# EAGLE design macro_rat (EAGLE 9.6.2)
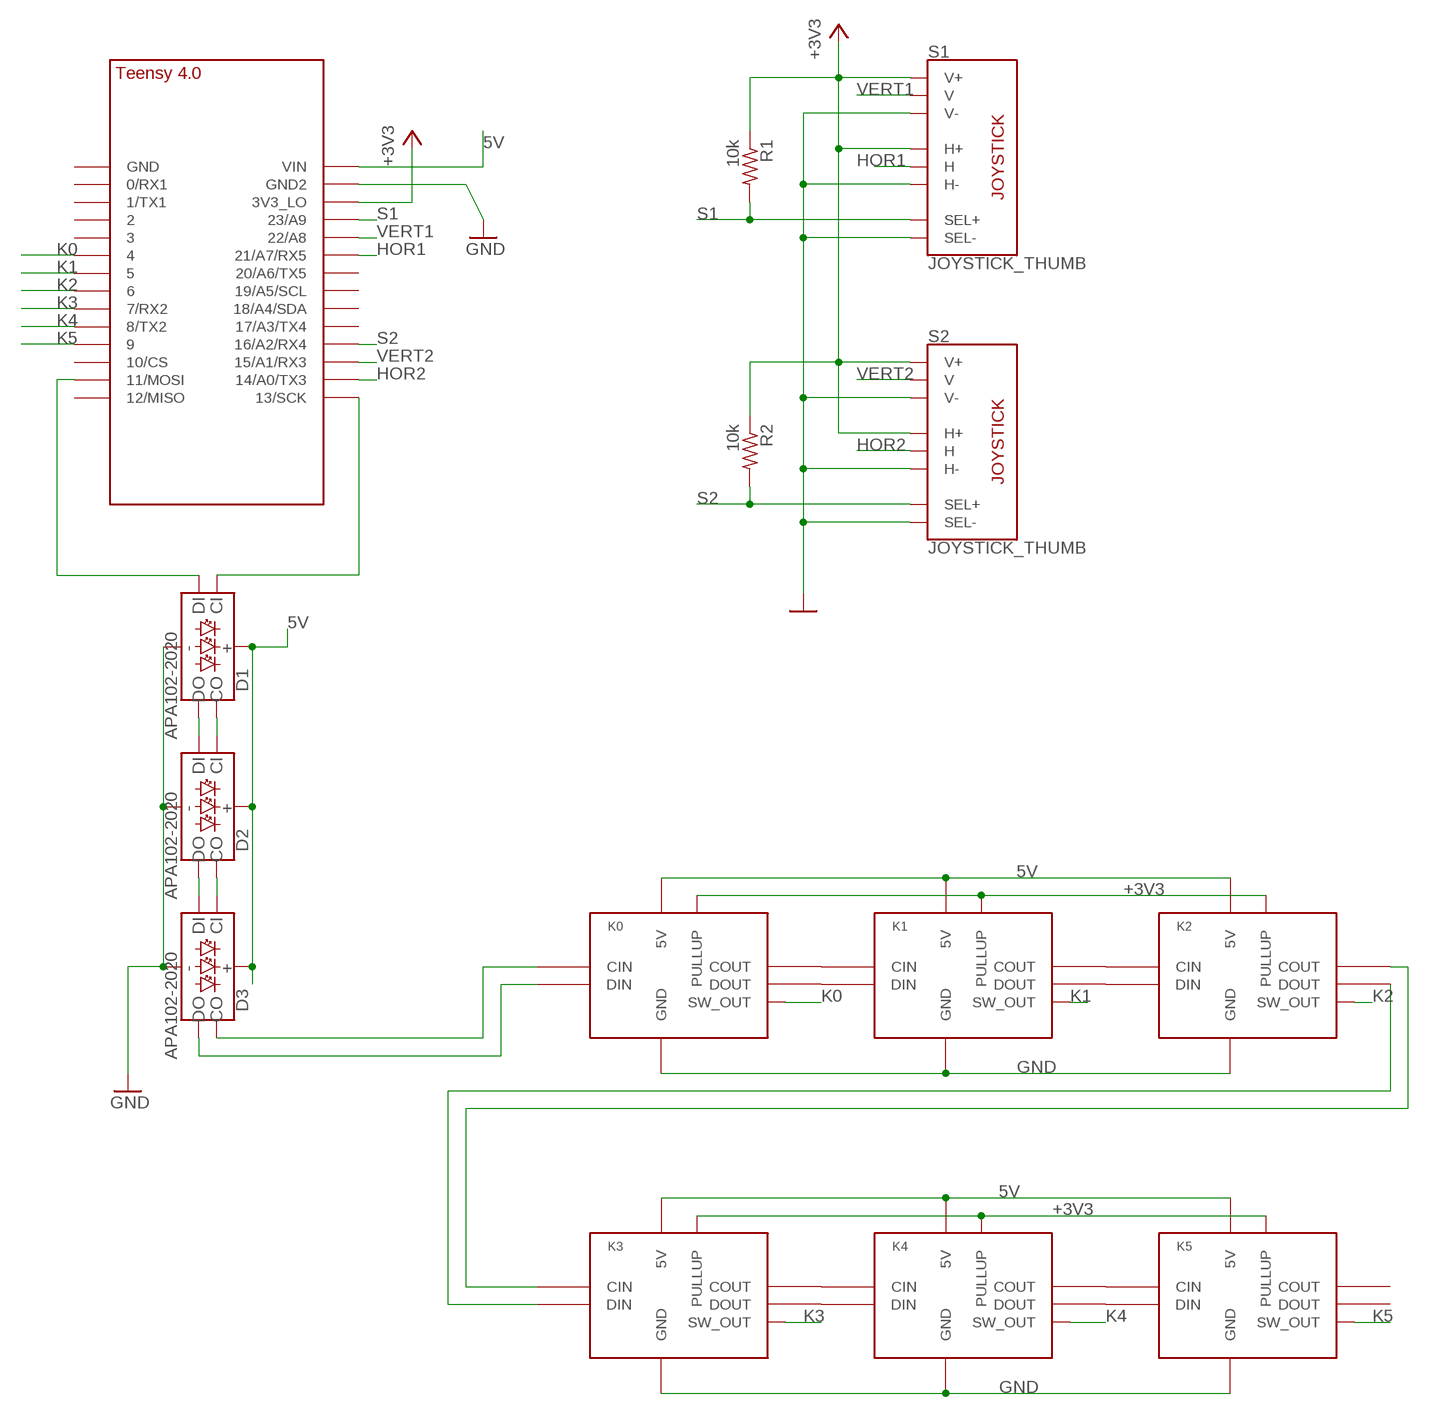
[diagram p0: schematic, sheet 1]

## Parts
D1  APA102-2020  [APA102-2020]
D2  APA102-2020  [APA102-2020]
D3  APA102-2020  [APA102-2020]
K0  KEY_LED_CHOC_ONESIDERIGHT_HAND  [KEY_CHOC_V2_RH]
K1  KEY_LED_CHOC_ONESIDERIGHT_HAND  [KEY_CHOC_V2_RH]
K2  KEY_LED_CHOC_ONESIDERIGHT_HAND  [KEY_CHOC_V2_RH]
K3  KEY_LED_CHOC_ONESIDERIGHT_HAND  [KEY_CHOC_V2_RH]
K4  KEY_LED_CHOC_ONESIDERIGHT_HAND  [KEY_CHOC_V2_RH]
K5  KEY_LED_CHOC_ONESIDERIGHT_HAND  [KEY_CHOC_V2_RH]
MCU  TEENSY_4.0-NOBOTTOM  [TEENSY_4.0-NOBOTTOM]
R1  10k  R-US_R0603  [R0603]
R2  10k  R-US_R0603  [R0603]
S1  JOYSTICK_THUMB  [JOYSTICK]
S2  JOYSTICK_THUMB  [JOYSTICK]

## Nets
5V: D1.5V_VIA(VCC) D1.VDD(VCC) D2.5V_VIA(VCC) D2.VDD(VCC) D3.5V_VIA(VCC) D3.VDD(VCC) K0.5V K0.VDD(5V) K1.5V K1.VDD(5V) K2.5V K2.VDD(5V) K3.5V K3.VDD(5V) K4.5V K4.VDD(5V) K5.5V K5.VDD(5V) MCU.VIN
+3V3: K0.PULLUP_V(PULLUP) K0.PULLUP_VIA(PULLUP) K1.PULLUP_V(PULLUP) K1.PULLUP_VIA(PULLUP) K2.PULLUP_V(PULLUP) K2.PULLUP_VIA(PULLUP) K3.PULLUP_V(PULLUP) K3.PULLUP_VIA(PULLUP) K4.PULLUP_V(PULLUP) K4.PULLUP_VIA(PULLUP) K5.PULLUP_V(PULLUP) K5.PULLUP_VIA(PULLUP) MCU.3V3_LO R1.1 R2.1 S1.H1(H+) S1.V1(V+) S2.H1(H+) S2.V1(V+)
GND: D1.GND D1.GND_VIA(GND) D2.GND D2.GND_VIA(GND) D3.GND D3.GND_VIA(GND) K0.GND K0.GND$1(GND) K0.GND$2(GND) K0.GND$3(GND) K0.GND$4(GND) K0.GND_VIA(GND) K1.GND K1.GND$1(GND) K1.GND$2(GND) K1.GND$3(GND) K1.GND$4(GND) K1.GND_VIA(GND) K2.GND K2.GND$1(GND) K2.GND$2(GND) K2.GND$3(GND) K2.GND$4(GND) K2.GND_VIA(GND) K3.GND K3.GND$1(GND) K3.GND$2(GND) K3.GND$3(GND) K3.GND$4(GND) K3.GND_VIA(GND) K4.GND K4.GND$1(GND) K4.GND$2(GND) K4.GND$3(GND) K4.GND$4(GND) K4.GND_VIA(GND) K5.GND K5.GND$1(GND) K5.GND$2(GND) K5.GND$3(GND) K5.GND$4(GND) K5.GND_VIA(GND) MCU.GND2 S1.B2A(SEL-) S1.H3(H-) S1.V3(V-) S2.B2A(SEL-) S2.H3(H-) S2.V3(V-)
HOR1: MCU.21/A7(21/A7/RX5) S1.H2(H)
HOR2: MCU.14/A0(14/A0/TX3) S2.H2(H)
K0: K0.OUT(SW_OUT) K0.OUT_UP(SW_OUT) MCU.4/CANRX
K1: K1.OUT(SW_OUT) K1.OUT_UP(SW_OUT) MCU.5
K2: K2.OUT(SW_OUT) K2.OUT_UP(SW_OUT) MCU.6
K3: K3.OUT(SW_OUT) K3.OUT_UP(SW_OUT) MCU.7(7/RX2)
K4: K4.OUT(SW_OUT) K4.OUT_UP(SW_OUT) MCU.8(8/TX2)
K5: K5.OUT(SW_OUT) K5.OUT_UP(SW_OUT) MCU.9/CS
N$1: K0.CKO(COUT) K1.CKI(CIN)
N$2: K0.SDO(DOUT) K1.SDI(DIN)
N$3: K1.CKO(COUT) K2.CKI(CIN)
N$4: K1.SDO(DOUT) K2.SDI(DIN)
N$5: K3.CKO(COUT) K4.CKI(CIN)
N$6: K3.SDO(DOUT) K4.SDI(DIN)
N$7: K4.CKO(COUT) K5.CKI(CIN)
N$8: D1.SDO(DO) D2.SDI(DI)
N$9: D1.CKO(CO) D2.CKI(CI)
N$10: D2.SDO(DO) D3.SDI(DI)
N$11: D2.CKO(CO) D3.CKI(CI)
N$12: D1.CKI(CI) MCU.13/SCK
N$13: D1.SDI(DI) MCU.11/MOSI
N$14: K4.SDO(DOUT) K5.SDI(DIN)
N$15: D3.CKO(CO) K0.CKI(CIN)
N$16: D3.SDO(DO) K0.SDI(DIN)
N$17: K2.SDO(DOUT) K3.SDI(DIN)
N$18: K2.CKO(COUT) K3.CKI(CIN)
S1: MCU.23/A9 R1.2 S1.B1A(SEL+)
S2: MCU.16/A2(16/A2/RX4) R2.2 S2.B1A(SEL+)
VERT1: MCU.22/A8 S1.V2(V)
VERT2: MCU.15/A1(15/A1/RX3) S2.V2(V)
Unconnected: K5.CKO(COUT) K5.SDO(DOUT) MCU.0/RX(0/RX1) MCU.1/TX(1/TX1) MCU.2 MCU.3/CANTX MCU.10/CS MCU.12/MISO MCU.17/A3(17/A3/TX4) MCU.18/A4/SDA MCU.19/A5/SCL MCU.20/A6(20/A6/TX5) MCU.GND

## Library data of the parts
D1-D3 = custom:APA102: Addressable RGB LED - 2 Wire Common names: APA102, Dotstar, etc. Packages: 5050 2020 SparkFun Products: SparkFun Lumenati Boards <https://www.sparkfun.com/categories/405>; PROD_ID: DIO-14111
K0 K1-K5 = custom:KEY_LED_CHOC_ONESIDE
MCU = Teensy-4.0:TEENSY_4.0-NOBOTTOM
R1 R2 = adafruit:R-US_: RESISTOR, American symbol
S1 S2 = SparkFun-Switches:JOYSTICK_THUMB: Analog Thumb Joystick This is a joystick very similar to the ‘analog’ joysticks on PS2 (PlayStation 2) controllers. Directional movements are simply two potentiometers - one for each axis. Pots are ~10k each. This joystick also has a select button that is actuated when the joystick is pressed down. SparkFun Products Thumb Joystick <https://www.sparkfun.com/products/9032> (COM-09032) SparkFun Thumb Joystick Breakout <https://www.sparkfun.com/products/9110> (BOB-09110) SparkFun Joystick Shield Kit <https://www.sparkfun.com/products/9760> (DEV-09760); PROD_ID: COMP-09744; SF_SKU: COM-09032

## Net classes
0 default: width 0.127 mm

## Board
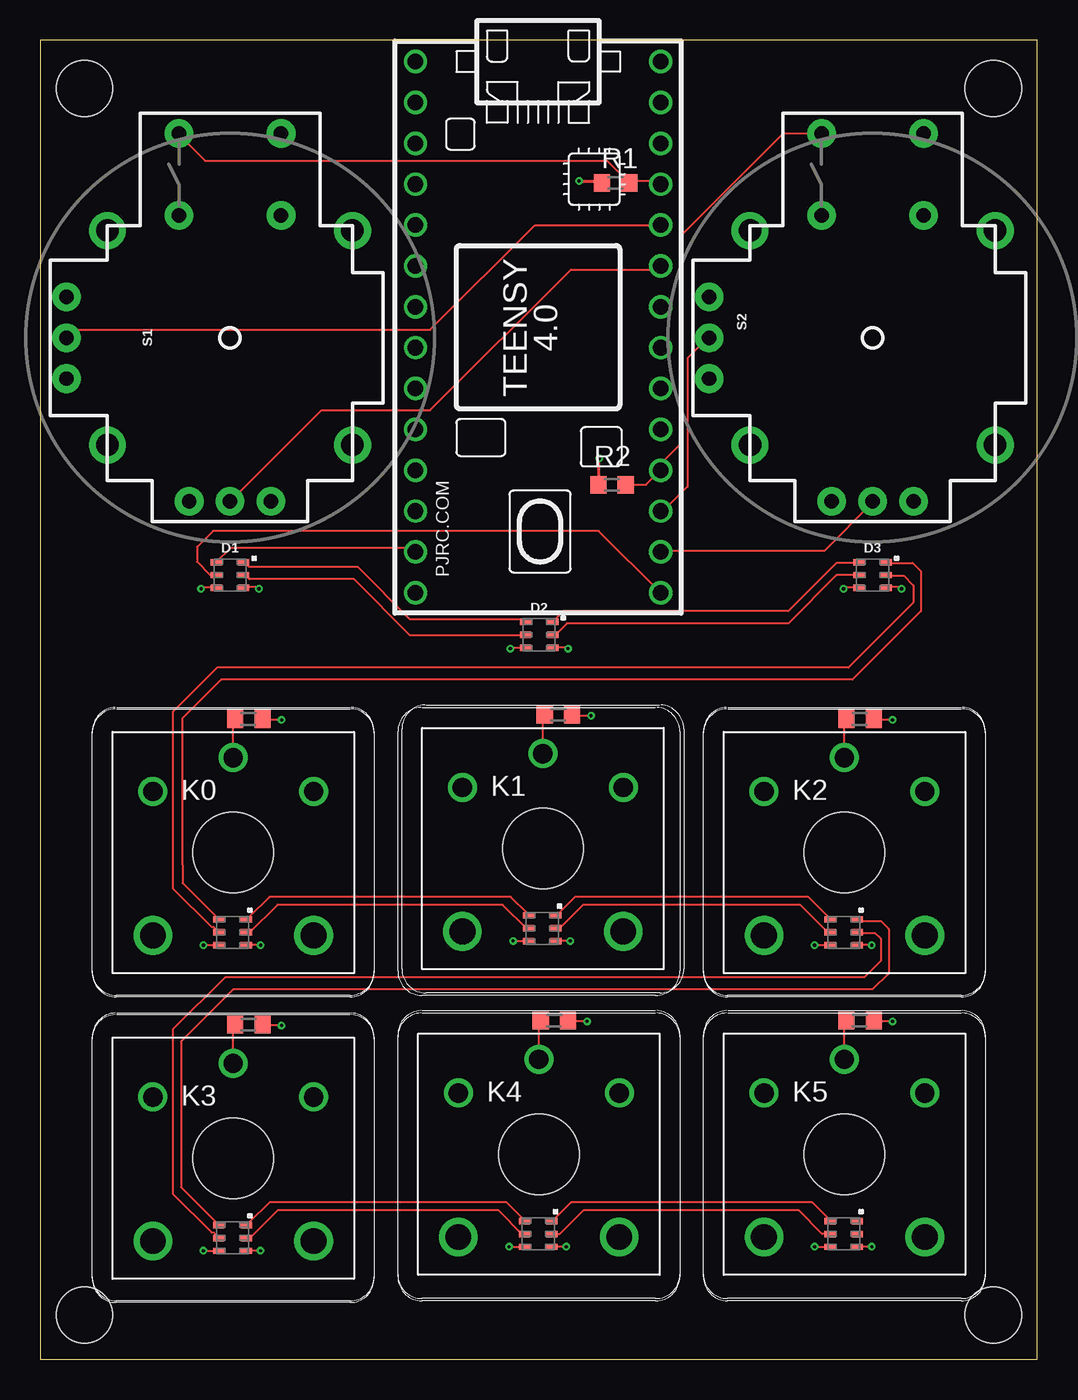
[diagram p1: board, top side]
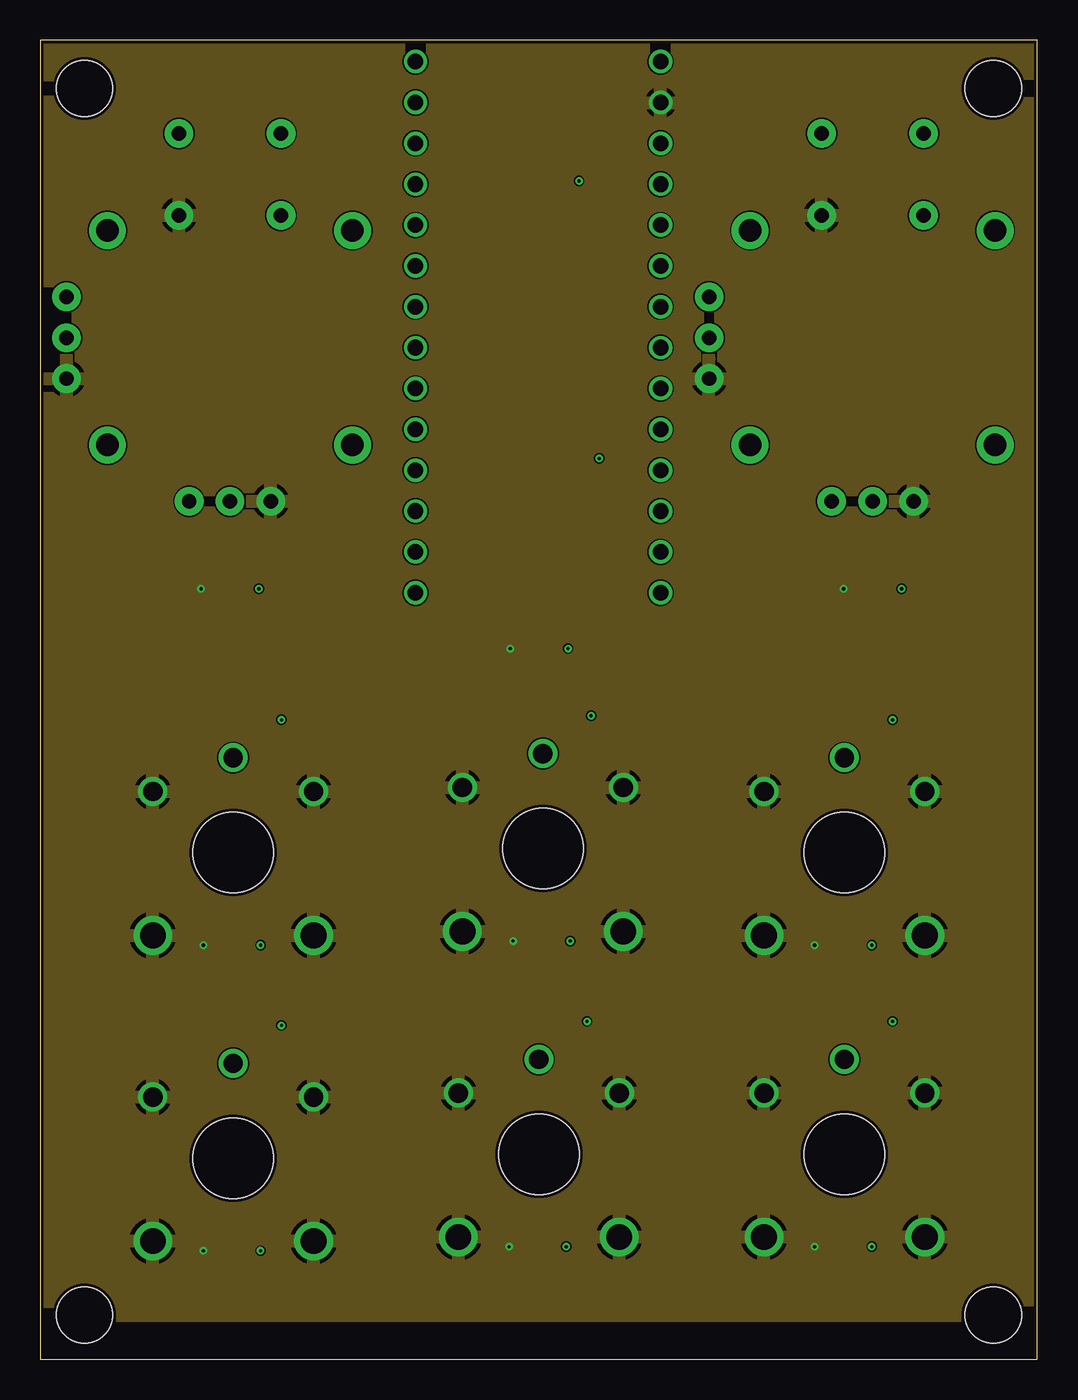
[diagram p2: board, inner layer Route2]
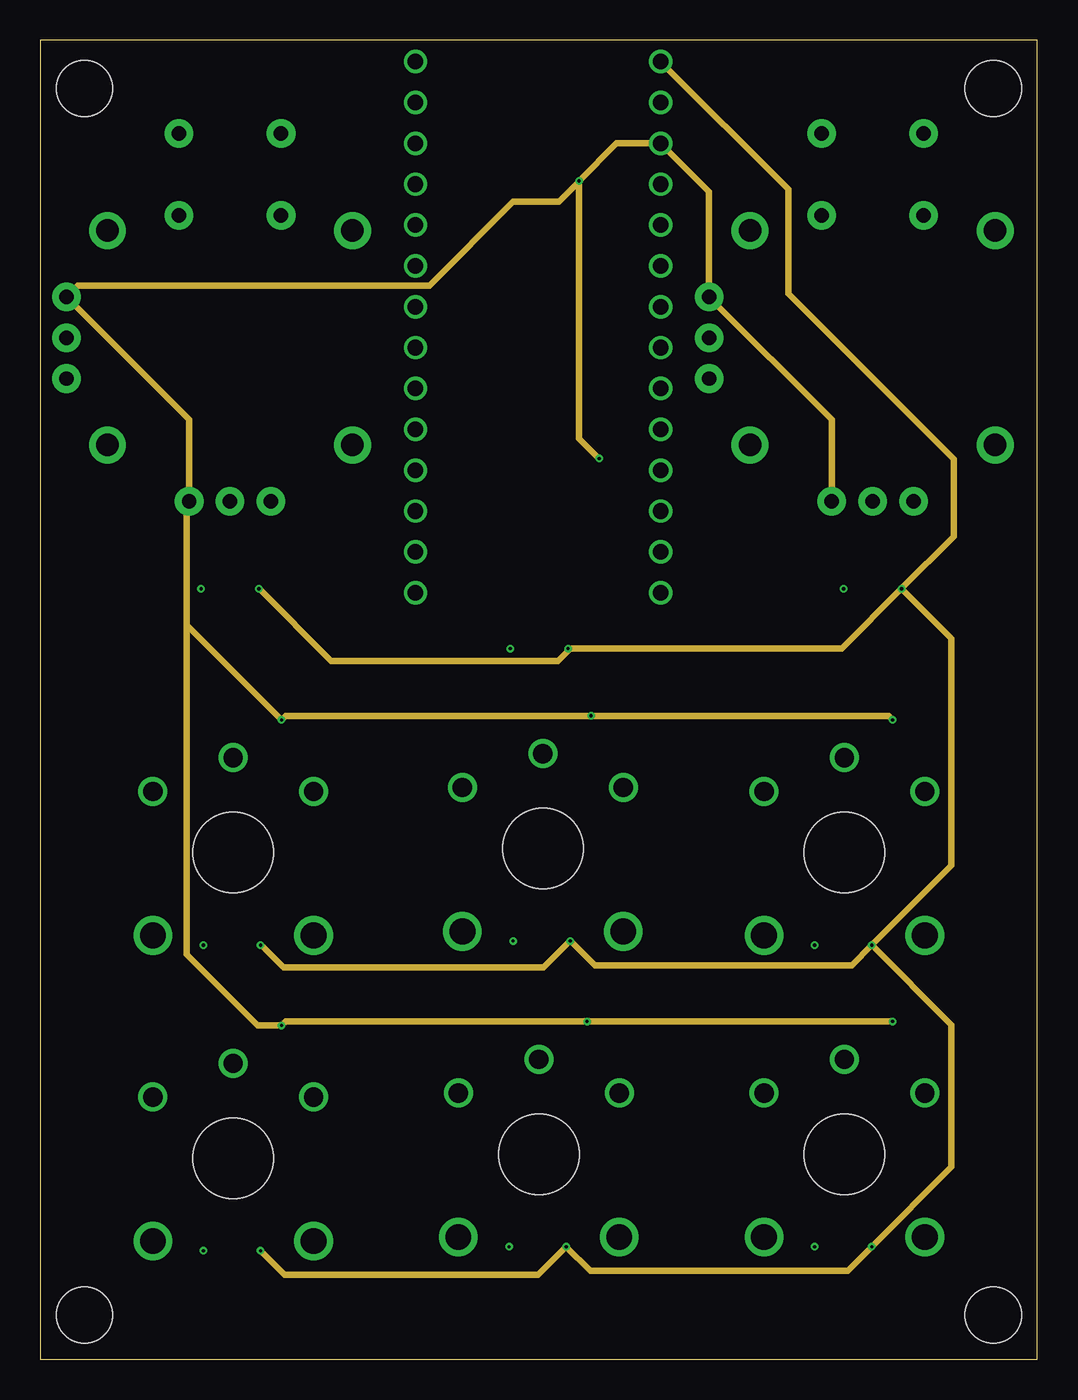
[diagram p3: board, inner layer Route15]
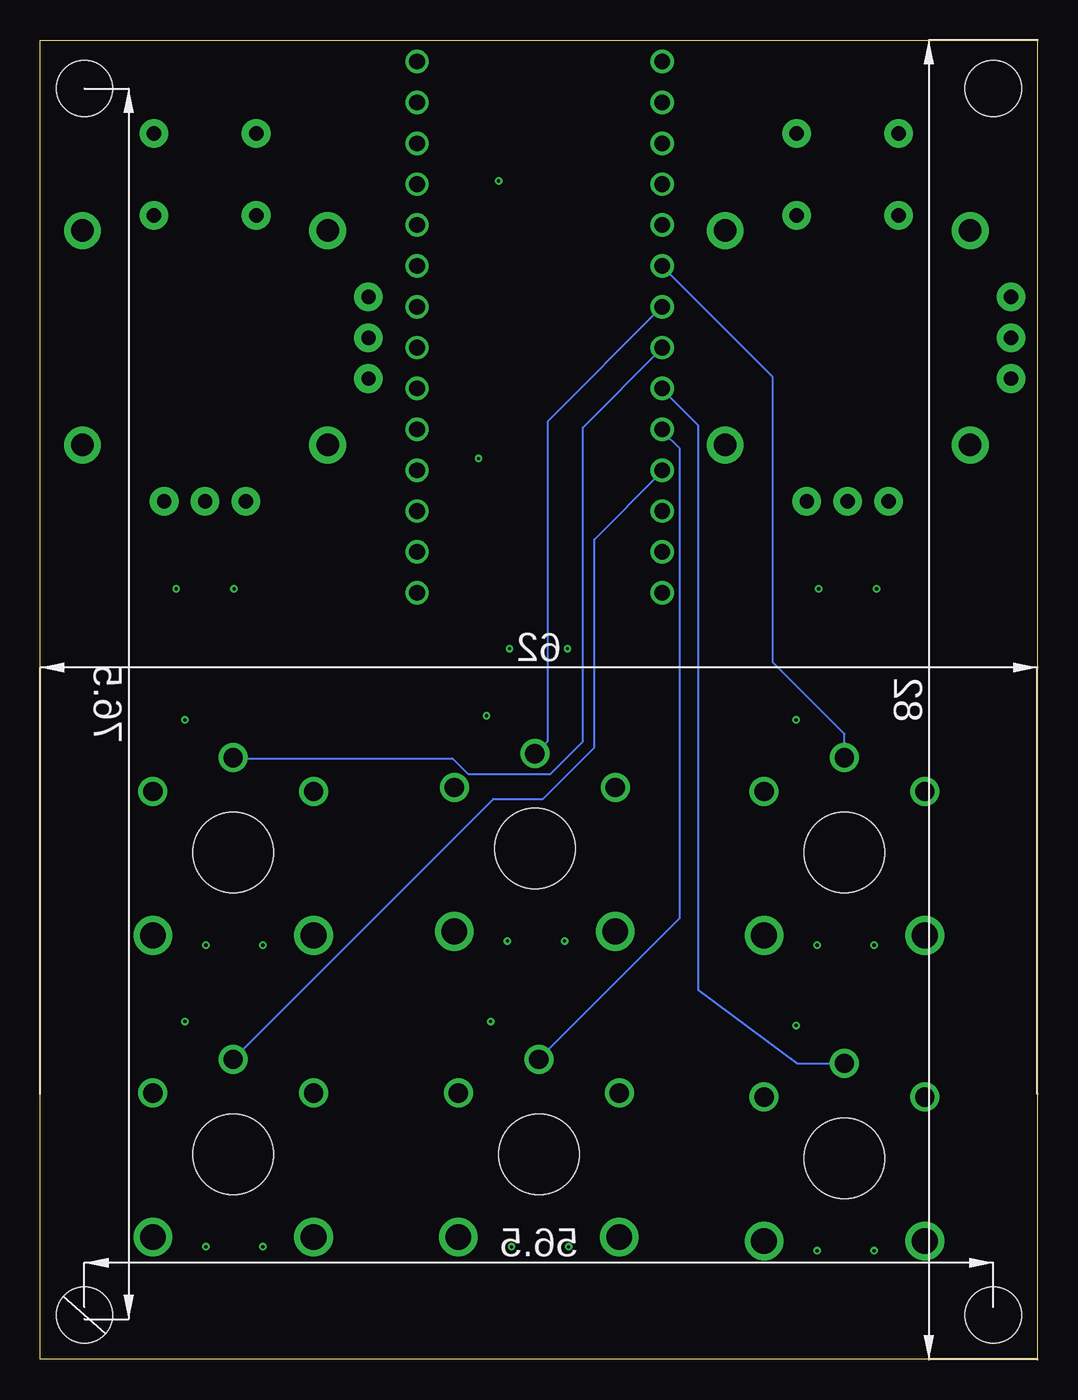
[diagram p4: board, bottom side, seen from below]

Size 62 x 82 mm. Coordinates in mm from the lower left corner, seen from the top.
Outline: 0,0 62,0 62,82 0,82 0,0
Copper layers (1+2*15+16): Top 0.035mm / dielectric 0.2mm / Route2 0.035mm / dielectric 0.15mm / Route15 0.035mm / dielectric 0.2mm / Bottom 0.035mm
Design rules "jlcpcb": minimum track width 3.5mil, minimum drill 0.2mm, track to track 3.5mil, track to pad 0.2mm, pad to pad 5mil, via to via 10mil, smd to smd 5mil, copper to edge 0.2mm, drill to drill 0.5mm, minimum pad ring 0.13mm, minimum via ring 0.13mm, stop-mask expansion 4mil, vias tented up to drill 0mil, thermal gap 10mil
Holes 3.5 mm at 2.75,2.75 59.25,2.75 59.25,79 2.75,79

### Footprints (pad centres in the part's own frame; a part is rotated, then mirrored left to right if it is on the bottom)
APA102-2020 = drill 0.2: 5V_VIA 1.8,-0.6; GND_VIA -1.8,-0.6 | smd 0.7 x 0.4: CKI -0.85,0.254; CKO 0.85,0.254; GND -0.85,-0.546; SDI -0.85,1.054; SDO 0.85,1.054; VDD 0.85,-0.546
KEY_CHOC_V2_RH = drill 0.2: 5V 9.2,1.75; GND_VIA 5.65,1.75; PULLUP_VIA 10.5,15.75 | smd 0.7 x 0.4: CKI 6.61,2.543; CKO 8.31,2.543; GND 6.61,1.743; SDI 6.61,3.343; SDO 8.31,3.343; VDD 8.31,1.743 | drill 1.6: GND$1 2.5,2.35; GND$2 12.5,2.35 | drill 1.2: GND$3 12.5,11.3; GND$4 2.5,11.3; OUT 7.5,13.4 | smd 1 x 1.1: OUT_UP 7.62,15.81; PULLUP_V 9.32,15.81 | hole 5: 7.5,7.5
TEENSY_4.0-NOBOTTOM = drill 0.965: 0/RX -13.97,-7.62; 1/TX -11.43,-7.62; 2 -8.89,-7.62; 3/CANTX -6.35,-7.62; 3V3_LO -11.43,7.62; 4/CANRX -3.81,-7.62; 5 -1.27,-7.62; 6 1.27,-7.62; 7 3.81,-7.62; 8 6.35,-7.62; 9/CS 8.89,-7.62; 10/CS 11.43,-7.62; 11/MOSI 13.97,-7.62; 12/MISO 16.51,-7.62; 13/SCK 16.51,7.62; 14/A0 13.97,7.62; 15/A1 11.43,7.62; 16/A2 8.89,7.62; 17/A3 6.35,7.62; 18/A4/SDA 3.81,7.62; 19/A5/SCL 1.27,7.62; 20/A6 -1.27,7.62; 21/A7 -3.81,7.62; 22/A8 -6.35,7.62; 23/A9 -8.89,7.62; GND -16.51,-7.62; GND2 -13.97,7.62; VIN -16.51,7.62
R0603 = smd 1 x 1.1: 1 -0.85,0; 2 0.85,0
JOYSTICK = drill 0.9 pad 1.778: B1A -3.175,12.7; B1B 3.175,12.7; B2A -3.175,7.62; B2B 3.175,7.62 | drill 0.889 pad 1.778: H1 -2.54,-10.16; H2 0,-10.16; H3 2.54,-10.16; V1 -10.16,2.54; V2 -10.16,0; V3 -10.16,-2.54 | drill 1.397 pad 2.286: MOUNT1 -7.62,6.668; MOUNT2 -7.62,-6.668; MOUNT3 7.62,-6.668; MOUNT4 7.62,6.668

### Placement (x,y rotation side)
D1  11.8,48.5 0 top
D2  31.02,44.78 0 top
D3  51.75,48.5 0 top
K0  4.5,24 0 top
K1  23.75,24.25 0 top
K2  42.5,24 0 top
K3  4.5,5 0 top
K4  23.5,5.25 0 top
K5  42.5,5.25 0 top
MCU  30.95,64.16 270 top
R1  35.77,73.13 0 top
R2  35.55,54.37 0 top
S1  11.8,63.5 0 top
S2  51.75,63.5 0 top

### Tracks (layer width: path | path; a pad name or v marks a point on that pad's centre or on a via)
5V
  Top 0.127: K3.5V 13,6.75 K3.VDD | K0.5V 13,25.75 K0.VDD | K4.5V 32,7 K4.VDD | K1.5V 32.25,26 K1.VDD | D1.VDD 12.75,48 13.5,48 D1.5V_VIA | D2.VDD 32,44.25 32.75,44.25 D2.5V_VIA | K5.5V 51,7 K5.VDD | K2.5V 51,25.75 K2.VDD | D3.VDD 52.75,48 53.5,48 D3.5V_VIA
  Route15 0.406: K0.5V 13.73,25.75 15.13,24.35 31.3,24.35 K1.5V 32.98,26 34.48,24.5 50.45,24.5 K2.5V | K3.5V 15.2,5.25 30.95,5.25 K4.5V 34.2,5.5 50.2,5.5 K5.5V 56.65,11.95 56.65,20.8 K2.5V | D3.5V_VIA 49.83,44.18 D2.5V_VIA 32.82,44.03 32.19,43.4 18.1,43.4 D1.5V_VIA | D3.5V_VIA 56.65,44.8 56.65,30.7 K2.5V | MCU.VIN 46.5,72.74 46.5,66.25 56.8,55.95 56.8,51.15 D3.5V_VIA
+3V3  (via drill 0.2)
  Top 0.127: K3.PULLUP_VIA 14,20.75 K3.PULLUP_V | K4.PULLUP_VIA 33,21 K4.PULLUP_V | K0.PULLUP_VIA 14,39.75 K0.PULLUP_V | K5.PULLUP_VIA 52,21 K5.PULLUP_V | K1.PULLUP_VIA 33.25,40 K1.PULLUP_V | K2.PULLUP_VIA 52,39.75 K2.PULLUP_V
  Top 0.2: v33.5,73.25 34.8,73.25 R1.1 | v34.75,56 34.7,55.95 R2.1
  Route15 0.406: S2.H1 49.21,58.42 S2.V1 41.59,72.57 MCU.3V3_LO 35.84,75.59 v33.5,73.25 | v33.5,73.25 33.5,73.2 32.25,71.95 29.41,71.95 24.19,66.74 2.34,66.74 S1.V1 9.26,58.42 S1.H1 9.1,53.18 9.1,45.65 | v33.5,73.25 33.5,57.25 v34.75,56 | K5.PULLUP_VIA K4.PULLUP_VIA 15.25,21 K3.PULLUP_VIA 13.51,20.75 9.1,25.16 9.1,45.65 | K2.PULLUP_VIA 52.75,40 K1.PULLUP_VIA 15.25,40 K0.PULLUP_VIA 9.1,45.65
GND
  Top 0.127: K3.GND_VIA 11,6.75 K3.GND | K4.GND_VIA 30,7 K4.GND | K0.GND_VIA 11,25.75 K0.GND | K1.GND_VIA 30.25,26 K1.GND | K5.GND_VIA 49,7 K5.GND | D1.GND 10.75,48 10,48 D1.GND_VIA | D2.GND 30,44.25 29.25,44.25 D2.GND_VIA | K2.GND_VIA 49,25.75 K2.GND | D3.GND 50.75,48 50,48 D3.GND_VIA
  pour Route2: 0,82 0,2.75 62,2.75 62,82
HOR1
  Top 0.127: MCU.21/A7 38.5,67.75 33,67.75 24.25,59 17.5,59 12,53.5 S1.H2
HOR2
  Top 0.127: MCU.14/A0 38.75,50.25 48.75,50.25 51.75,53.25 S2.H2
K0
  Top 0.127: K0.OUT 12,39.75 K0.OUT_UP
  Bottom 0.127: K0.OUT 12,38.88 16.45,43.33 16.45,61.06 23.32,67.93 MCU.4/CANRX
K1
  Top 0.127: K1.OUT 31.25,40 K1.OUT_UP
  Bottom 0.127: MCU.5 23.43,65.42 23.43,65.34 30.44,58.32 30.44,38.44 31.2,37.68 K1.OUT
K2
  Top 0.127: K2.OUT 50,39.75 K2.OUT_UP
  Bottom 0.127: MCU.6 23.43,62.83 23.43,62.75 28.26,57.92 28.26,38.39 30.27,36.39 35.41,36.39 36.38,37.36 49.98,37.36 K2.OUT
K3
  Top 0.127: K3.OUT 12,20.75 K3.OUT_UP
  Bottom 0.127: MCU.7 23.32,60.28 21.08,58.04 21.08,22.95 14.94,18.4 K3.OUT
K4
  Top 0.127: K4.OUT 31,21 K4.OUT_UP
  Bottom 0.127: MCU.8 23.32,57.76 23.32,57.68 22.24,56.6 22.24,27.43 30.98,18.68 K4.OUT
K5
  Top 0.127: K5.OUT 50,21 K5.OUT_UP
  Bottom 0.127: MCU.9/CS 23.43,55.17 23.43,55.09 27.54,50.97 27.54,38.03 30.74,34.84 33.83,34.84 49.98,18.68 K5.OUT
N$1
  Top 0.127: K0.CKO 13,26.5 14.75,28.25 28.75,28.25 30.25,26.75 K1.CKI
N$2
  Top 0.127: K0.SDO 13,27.5 14.25,28.75 29.25,28.75 30.25,27.75 K1.SDI
N$3
  Top 0.127: K1.CKO 32.25,26.75 33.75,28.25 47.25,28.25 49,26.5 K2.CKI
N$4
  Top 0.127: K1.SDO 32.25,27.75 33.25,28.75 47.75,28.75 49,27.5 K2.SDI
N$5
  Top 0.127: K3.CKO 13,7.5 14.75,9.25 28.5,9.25 30,7.75 K4.CKI
N$6
  Top 0.127: K3.SDO 13,8.5 14.25,9.75 29,9.75 30,8.75 K4.SDI
N$7
  Top 0.127: K5.CKI 48.61,7.79 47.15,9.25 33.77,9.25 32.31,7.79 K4.CKO
N$8
  Top 0.127: D1.SDO 12.75,49.5 13,49.25 19.75,49.25 23,46 30,46 D2.SDI
N$9
  Top 0.127: D1.CKO 12.75,48.75 13,48.5 19.5,48.5 23,45 30,45 D2.CKI
N$10
  Top 0.127: D2.SDO 32,46 32.5,46.5 46.5,46.5 49.5,49.5 50.75,49.5 D3.SDI
N$11
  Top 0.127: D2.CKO 32,45 32.75,45.75 46.5,45.75 49.5,48.75 50.75,48.75 D3.CKI
N$12
  Top 0.127: MCU.13/SCK 34.72,51.5 10.75,51.5 9.75,50.5 9.75,49.58 10.58,48.75 D1.CKI
N$13
  Top 0.127: MCU.11/MOSI 23.08,50.44 11.84,50.44 D1.SDI
N$14
  Top 0.127: K4.SDO 32,8.75 33,9.75 48,9.75 49,8.75 K5.SDI
N$15
  Top 0.127: D3.CKO 52.64,48.72 53.68,48.72 54.29,48.1 54.29,47.04 50.25,43 11,43 8.25,40.25 8.25,29.28 10.65,26.88 10.77,26.88 K0.CKI
N$16
  Top 0.127: D3.SDO 52.65,49.5 54.25,49.5 54.75,49 54.75,46.5 50.5,42.25 11.25,42.25 8.84,39.84 8.84,30.76 8.85,30.74 8.85,29.6 K0.SDI
N$17
  Top 0.127: K2.SDO 50.9,27.25 52.25,27.25 52.75,26.75 52.75,24 51.75,23 12,23 8.75,19.75 8.75,10.7 K3.SDI
N$18
  Top 0.127: K2.CKO 50.86,26.49 51.9,26.49 52.25,26.15 52.25,24.75 51.25,23.75 11.5,23.75 8.25,20.5 8.25,10.28 10.65,7.88 10.77,7.88 K3.CKI
S1
  Top 0.127: MCU.23/A9 38.5,73.25 36.75,73.25 R1.2 35.25,74.5 10.25,74.5 8.75,76 S1.B1A
S2
  Top 0.127: S2.B1A 46.17,76.2 39.81,69.83 39.81,56.9 38.57,55.66 MCU.16/A2 37.67,54.37 R2.2
VERT1
  Top 0.127: MCU.22/A8 38.5,70.5 30.75,70.5 24.25,64 2.25,64 1.75,63.5 S1.V2
VERT2
  Top 0.127: MCU.15/A1 38.75,52.75 40.25,54.25 40.25,62.25 41.5,63.5 S2.V2